# EAGLE design LT3045_1A_mini_module (EAGLE 7.6.0)
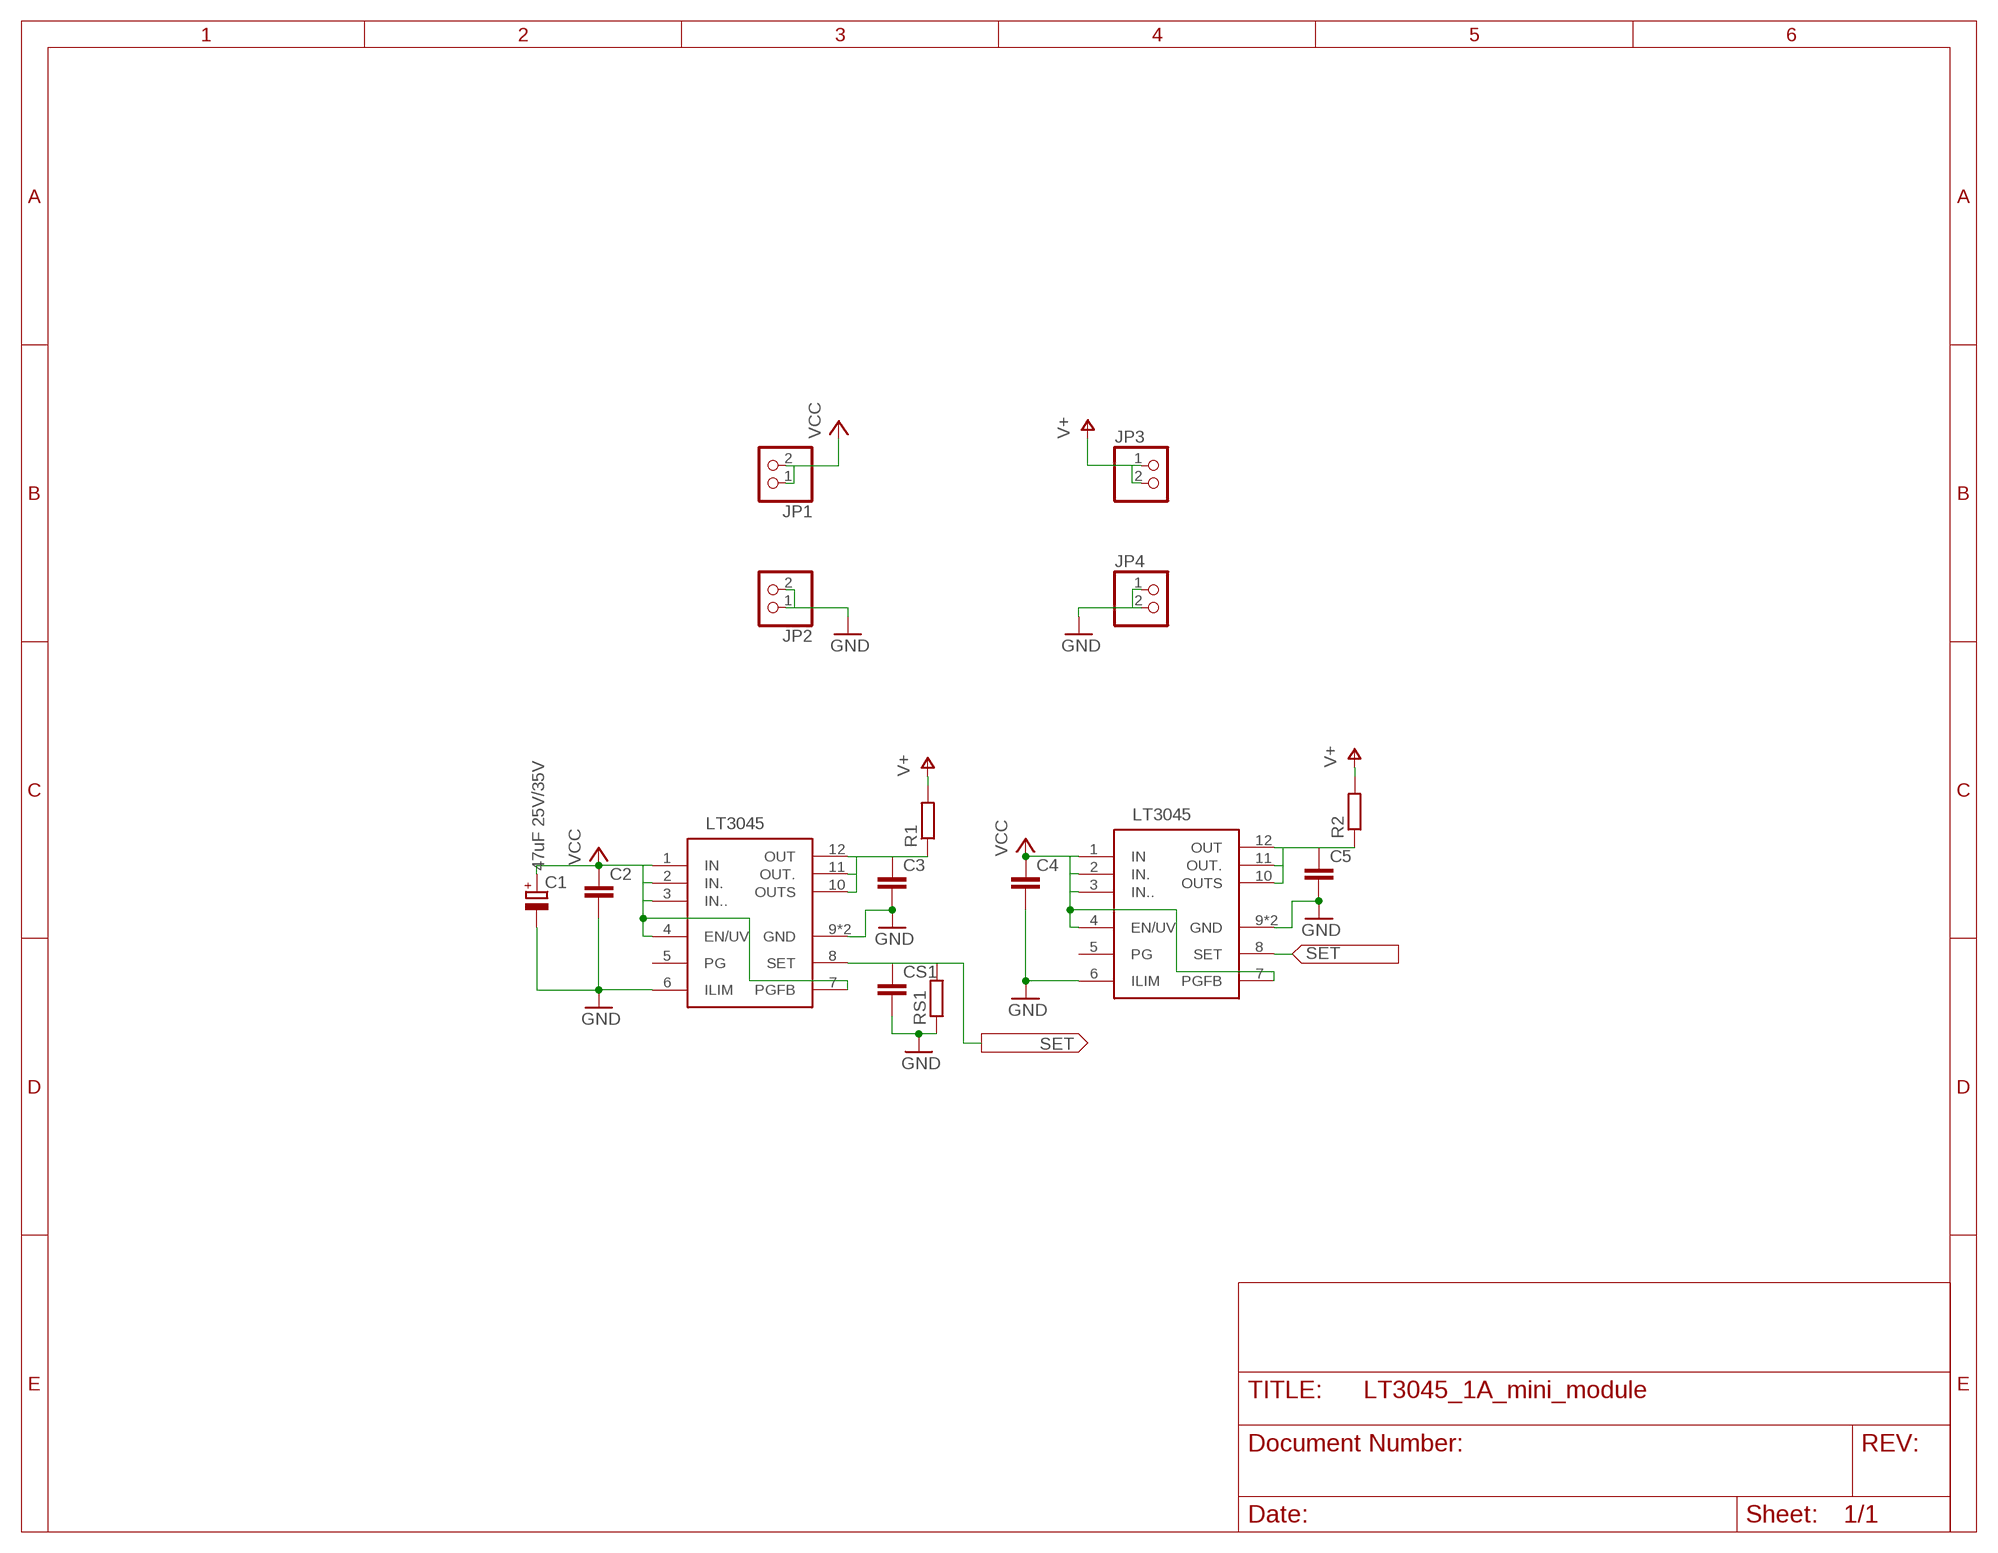
[diagram p0: schematic, sheet 1]

## Parts
C1  47uF 25V/35V  CPOL-EUD/7343-31R  [D/7343-31R]
C2  C-EUC1206  [C1206]
C3  C-EUC1206  [C1206]
C4  C-EUC1206  [C1206]
C5  C-EUC1206  [C1206]
CS1  C-EUC0805  [C0805]
JP1  PINHD-1X2  [1X02]
JP2  PINHD-1X2  [1X02]
JP3  PINHD-1X2  [1X02]
JP4  PINHD-1X2  [1X02]
R1  R-EU_R0805  [R0805]
R2  R-EU_R0805  [R0805]
RS1  R-EU_R0805  [R0805]
U1  LT3045  [MSOP12]
U2  LT3045  [MSOP12]

## Nets
GND: C1.- C2.2 C3.2 C4.2 C5.2 CS1.2 JP2.1 JP2.2 JP4.1 JP4.2 RS1.1 U1.6(ILIM) U1.9(GND) U1.EXP(GND) U2.6(ILIM) U2.9(GND) U2.EXP(GND)
N$1: C3.1 R1.1 U1.10(OUTS) U1.11(OUT.) U1.12(OUT)
N$2: C5.1 R2.1 U2.10(OUTS) U2.11(OUT.) U2.12(OUT)
SET1: CS1.1 RS1.2 U1.8(SET) U2.8(SET)
V+: JP3.1 JP3.2 R1.2 R2.2
VCC: C1.+ C2.1 C4.1 JP1.1 JP1.2 U1.1(IN) U1.2(IN.) U1.3(IN..) U1.4(EN/UV) U1.7(PGFB) U2.1(IN) U2.2(IN.) U2.3(IN..) U2.4(EN/UV) U2.7(PGFB)
Unconnected: U1.5(PG) U2.5(PG)

## Notes on the sheet
- LT3045
- LT3045

## Library data of the parts
C1 = resistor:CPOL-EU: POLARIZED CAPACITOR, European symbol
C2-C5 CS1 = resistor:C-EU: CAPACITOR, European symbol
JP1-JP4 = pinhead:PINHD-1X2: PIN HEADER
R1 R2 RS1 = resistor:R-EU_: RESISTOR, European symbol
U1 U2 = LT3045:LT3045

## Board
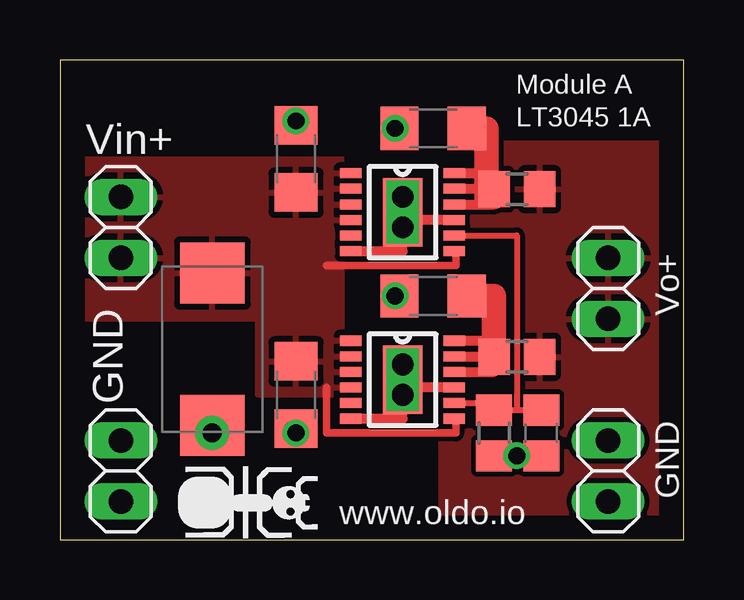
[diagram p1: board, top side]
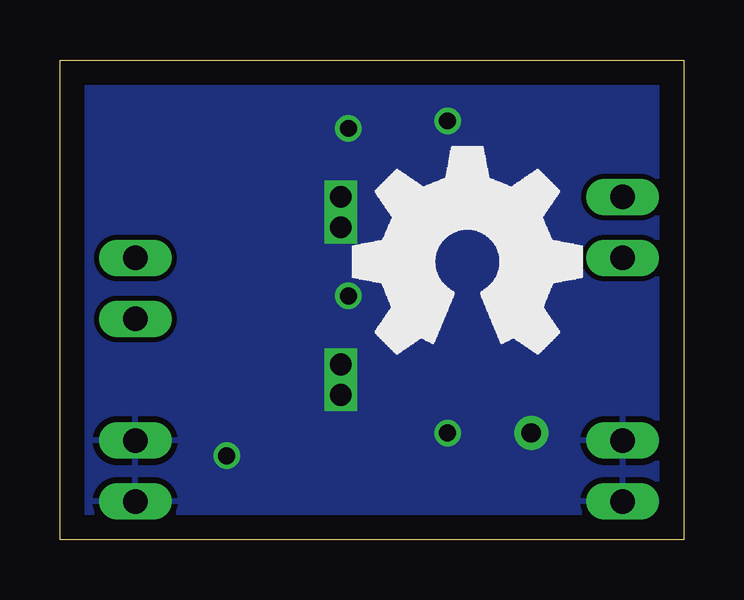
[diagram p2: board, bottom side, seen from below]

Size 26 x 20 mm. Coordinates in mm from the lower left corner, seen from the top.
Outline: 0,0 26,0 26,20 0,20 0,0
Copper layers (1*16): Top 0.035mm / dielectric 1.5mm / Bottom 0.035mm
Design rules "default *": minimum track width 10mil, minimum drill 24mil, track to track 8mil, track to pad 8mil, pad to pad 8mil, via to via 8mil, smd to smd 8mil, copper to edge 40mil, drill to drill 8mil, minimum pad ring 10mil, minimum via ring 8mil, stop-mask expansion 4mil, vias tented up to drill 32mil, thermal gap 10mil

### Footprints (pad centres in the part's own frame; a part is rotated, then mirrored left to right if it is on the bottom)
D/7343-31R = smd 2.55 x 2.7: + 3.175,0; - -3.175,0
C1206 = smd 1.6 x 1.8: 1 -1.4,0; 2 1.4,0
C0805 = smd 1.3 x 1.5: 1 -0.95,0; 2 0.95,0
1X02 = drill 1.016 long: 1 -1.27,0; 2 1.27,0
R0805 = smd 1.3 x 1.5: 1 -0.95,0; 2 0.95,0
MSOP12 = smd 0.9 x 0.42: 1 -2.163,1.625; 2 -2.163,0.975; 3 -2.163,0.325; 4 -2.163,-0.325; 5 -2.163,-0.975; 6 -2.163,-1.625; 7 2.15,-1.625; 8 2.15,-0.975; 9 2.15,-0.325; 10 2.15,0.325; 11 2.15,0.975; 12 2.15,1.625 | smd 1.65 x 2.85: EXP 0,0

### Placement (x,y rotation side)
C1  6.35,7.94 90 top
C2  9.84,6.03 270 top
C3  15.56,17.14 180 top
C4  9.84,15.88 90 top
C5  15.56,10.16 180 top
CS1  20.07,4.45 270 top
JP1  2.54,13.02 90 top
JP2  2.54,2.86 90 top
JP3  22.86,10.48 90 top
JP4  22.86,2.86 90 top
R1  19.05,14.61 0 top
R2  19.05,7.62 0 top
RS1  18.1,4.45 90 top
U1  14.29,13.65 0 top
U2  14.29,6.67 0 top

### Tracks (layer width: path | path; a pad name or v marks a point on that pad's centre or on a via)
GND  (via drill 0.7, 0.8 pad 1.42, 0.9)
  Top 0.254: RS1.1 v19.05,3.5 | CS1.2 v19.05,3.5 | v19.05,3.5 v19.05,3.49
  Top 0.406: U2.6 14.29,5.04 v14.29,6.03 | U2.9 14.29,6.34 v14.29,6.03 | v14.29,6.03 U2.EXP | U1.6 14.29,12.03 v14.29,13.02 U1.EXP 14.29,13.33 U1.9
  Top 1.016: C1.- v6.35,4.45 | C5.2 v13.97,10.16 | C3.2 v13.97,17.14 | v9.84,17.46 C4.2 | C2.2 v9.84,4.45
  other vias: 14.29,14.29 14.29,7.3
  pour Bottom: 0.95,0.95 25.08,0.95 25.08,19.05 0.95,19.05
N$1
  Top 0.406: U1.10 18.1,13.98 R1.1 | U1.11 18.1,14.63 R1.1 | U1.12 18.1,15.28 18.1,15.24 R1.1
  Top 1.016: C3.1 17.78,17.14 17.78,14.29 18.1,14.29 R1.1
N$2
  Top 0.406: U2.10 18.1,6.99 R2.1 | U2.11 18.1,7.64 R2.1 | U2.12 18.1,8.29 R2.1
  Top 1.016: C5.1 18.1,10.16 R2.1
SET1
  Top 0.254: CS1.1 19.05,5.39 | 19.05,5.39 RS1.2 18.1,5.69 U2.8 | U1.8 19.05,12.68 19.05,5.39
V+
  pour Top: 17.14,16.51 17.14,12.7 19.05,12.7 19.05,6.67 15.88,6.67 15.88,0.95 25.08,0.95 25.08,16.51
VCC
  Top 0.305: U1.7 16.51,12.03 16.51,11.43 11.11,11.43 | U2.7 16.51,5.04 16.51,4.45 11.11,4.45 11.11,6.35
  pour Top: 0.95,15.88 11.75,15.88 11.75,6.03 8.26,6.03 8.26,9.21 0.95,9.21

### Text on the board
tPlace: Module A | LT3045 1A | Vin+ | Vo+ | GND | GND | www.oldo.io